# Altium schematic sheet [2] ESP32.SchDoc: ESP32 KIT
size C; Organization: Altium Limited; Address1: L3, 12a Rodborough Rd; Address2: Frenchs Forest; Address3: NSW; Address4: Australia 2086; DocumentNumber: 2; Revision: 1.0; SheetNumber: 2; SheetTotal: 3
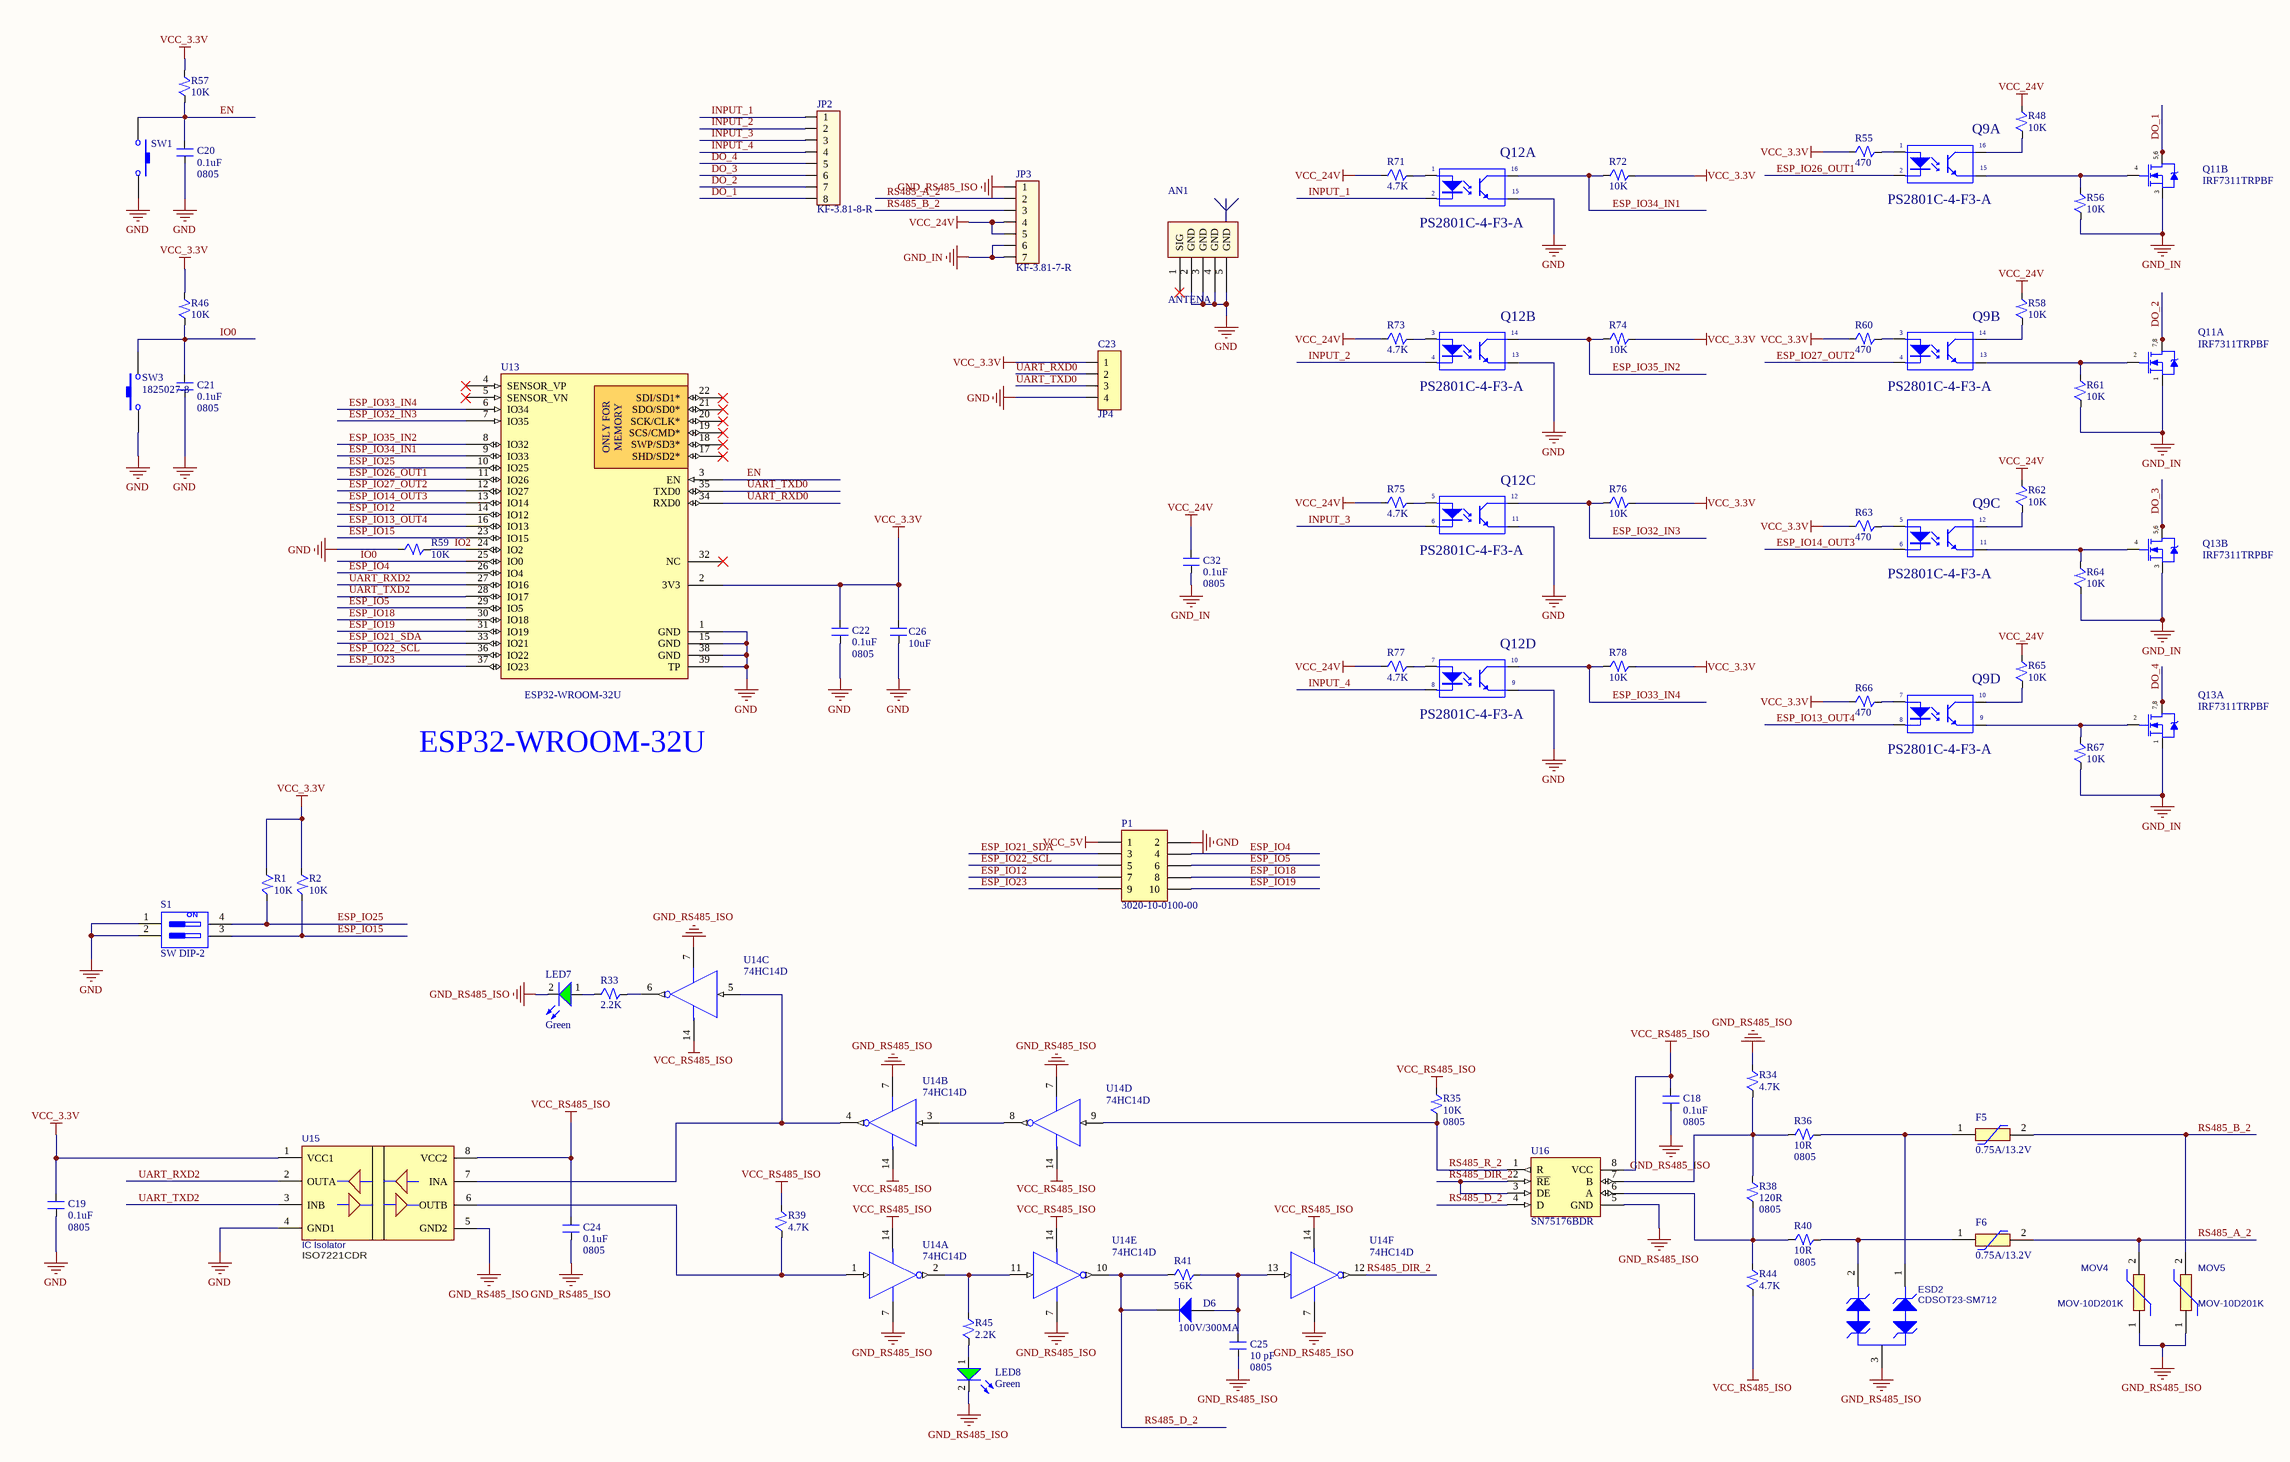
[diagram p0: [2] ESP32.SchDoc]

## Parts
AN1  ANTENA  [DE ANTEN SMA CONG]
C18  0.1uF  Package: 0805  [CN-SMD-0805]
C19  0.1uF  Package: 0805  [CN-SMD-0805]
C20  0.1uF  Package: 0805  [CN-SMD-0805]
C21  0.1uF  Package: 0805  [CN-SMD-0805]
C22  0.1uF  Package: 0805  [CN-SMD-0805]
C23  JP4  [JP4-C1T]
C24  0.1uF  Package: 0805  [CN-SMD-0805]
C25  10 pF  Package: 0805  [CN-SMD-0805]
C26  10uF  [CN-SMD-0805]
C32  0.1uF  Package: 0805  [CN-SMD-0805]
D6  100V/300MA  [SOD-123]
ESD2  CDSOT23-SM712  [SOT-323_ESD]
F5  0.75A/13.2V  [MINISMDC050F2]
F6  0.75A/13.2V  [MINISMDC050F2]
JP2  KF-3.81-8-R  [KF-3.81-8-R]
JP3  KF-3.81-7-R  [KF-3.81-7-R]
LED7  value Green  [LED5G]  (hidden comment: LED_G_5)
LED8  value Green  [LED5G]  (hidden comment: LED_G_5)
MOV4  MOV-10D201K  [MOV10D201KTR]
MOV5  MOV-10D201K  [MOV10D201KTR]
P1  3020-10-0100-00  [IDC_HDR_M_2X5_2.54_THG]
Q9  PS2801C-4-F3-A  [PS2801C-4_REN-L]  (parts A,B,C,D of 4)
Q11  IRF7311TRPBF  [SO8]  (parts A,B of 2)
Q12  PS2801C-4-F3-A  [PS2801C-4_REN-L]  (parts A,B,C,D of 4)
Q13  IRF7311TRPBF  [SO8]  (parts A,B of 2)
R1  10K  [RES_0805]
R2  10K  [RES_0805]
R33  2.2K  [RES_0805]
R34  4.7K  [RES_0805]
R35  10K  Package: 0805  [RES_0805]
R36  10R  Package: 0805  [RES_0805]
R38  120R  Package: 0805  [RES_0805]
R39  4.7K  [RES_0805]
R40  10R  Package: 0805  [RES_0805]
R41  56K  [RES_0805]
R44  4.7K  [RES_0805]
R45  2.2K  [RES_0805]
R46  10K  [RES_0805]
R48  10K  [RES_0805]
R55  470  [RES_0805]
R56  10K  [RES_0805]
R57  10K  [RES_0805]
R58  10K  [RES_0805]
R59  10K  [RES_0805]
R60  470  [RES_0805]
R61  10K  [RES_0805]
R62  10K  [RES_0805]
R63  470  [RES_0805]
R64  10K  [RES_0805]
R65  10K  [RES_0805]
R66  470  [RES_0805]
R67  10K  [RES_0805]
R71  4.7K  [RES_0805]
R72  10K  [RES_0805]
R73  4.7K  [RES_0805]
R74  10K  [RES_0805]
R75  4.7K  [RES_0805]
R76  10K  [RES_0805]
R77  4.7K  [RES_0805]
R78  10K  [RES_0805]
S1  SW DIP-2  [DIP-SW-2-SIDE ENTRY]
SW1  RS-282G05A3-SM RT  [SW_RS-282G05A3-SM RT]  (value not drawn)
SW3  1825027-8  [SW_1825027-8]
U13  ESP32-WROOM-32U  [ESP32-WROOM-32U]
U14  74HC14D  [SOIC-14]  (parts A,B,C,D,E,F of 6)
U15  IC Isolator  Part Number: ISO7221CDR  [8-SOIC_ISO]
U16  SN75176BDR  [SOIC-8]

## Nets
GND: AN1.2(GND) AN1.3(GND) AN1.4(GND) AN1.5(GND) C19.1 C20.1 C21.1 C22.1 C23.4 C26.1 P1.2 Q12.9 Q12.11 Q12.13 Q12.15 R59.1 S1.1(A1) S1.2(A2) SW1.2 SW3.1 U13.1(GND) U13.15(GND) U13.38(GND) U13.39(TP) U15.4(GND1)
GND_IN: C32.1 JP3.6 JP3.7 Q11.1(S) Q11.3(S) Q13.1(S) Q13.3(S) R56.1 R61.1 R64.1 R67.1
GND_RS485_ISO: C18.1 C24.1 C25.1 ESD2.3(A) JP3.1 LED7.2(K) LED8.2(K) MOV4.1 MOV5.1 R34.2 U14.7(GND) U15.5(GND2) U16.5(GND)
VCC_3.3V: C19.2 C22.2 C23.1 C26.2 R1.1 R2.1 R46.2 R55.1 R57.2 R60.1 R63.1 R66.1 R72.2 R74.2 R76.2 R78.2 U13.2(3V3) U15.1(VCC1)
VCC_5V: P1.1
VCC_24V: C32.2 JP3.4 JP3.5 R48.2 R58.2 R62.2 R65.2 R71.1 R73.1 R75.1 R77.1
VCC_RS485_ISO: C18.2 C24.2 R35.2 R39.2 R44.1 U14.14(VCC) U15.8(VCC2) U16.8(VCC)
DO_1: JP2.8 Q11.5(D) Q11.6(D)
DO_2: JP2.7 Q11.7(D) Q11.8(D)
DO_3: JP2.6 Q13.5(D) Q13.6(D)
DO_4: JP2.5 Q13.7(D) Q13.8(D)
EN: C20.2 R57.1 SW1.1 U13.3(EN)
ESP_IO4: P1.4 U13.26(IO4)
ESP_IO5: P1.6 U13.29(IO5)
ESP_IO12: P1.7 U13.14(IO12)
ESP_IO13_OUT4: Q9.8 U13.16(IO13)
ESP_IO14_OUT3: Q9.6 U13.13(IO14)
ESP_IO15: R2.2 S1.3(B2) U13.23(IO15)
ESP_IO18: P1.8 U13.30(IO18)
ESP_IO19: P1.10 U13.31(IO19)
ESP_IO21_SDA: P1.3 U13.33(IO21)
ESP_IO22_SCL: P1.5 U13.36(IO22)
ESP_IO23: P1.9 U13.37(IO23)
ESP_IO25: R1.2 S1.4(B1) U13.10(IO25)
ESP_IO26_OUT1: Q9.2 U13.11(IO26)
ESP_IO27_OUT2: Q9.4 U13.12(IO27)
ESP_IO32_IN3: Q12.12 R76.1 U13.7(IO35)
ESP_IO33_IN4: Q12.10 R78.1 U13.6(IO34)
ESP_IO34_IN1: Q12.16 R72.1 U13.9(IO33)
ESP_IO35_IN2: Q12.14 R74.1 U13.8(IO32)
INPUT_1: JP2.1 Q12.2
INPUT_2: JP2.2 Q12.4
INPUT_3: JP2.3 Q12.6
INPUT_4: JP2.4 Q12.8
IO0: C21.2 R46.1 SW3.2 U13.25(IO0)
IO2: R59.2 U13.24(IO2)
RS485_A_2: F6.2 JP3.2 MOV4.2
RS485_B_2: F5.2 JP3.3 MOV5.2
RS485_D_2: D6.2(K) R41.1 U14.10(5Y) U16.4(D)
RS485_DIR_2: U14.12(6Y) U16.2(~{RE}) U16.3(DE)
RS485_R_2: R35.1 U14.9(4A) U16.1(R)
UART_RXD0: C23.2 U13.34(RXD0)
UART_RXD2: U13.27(IO16) U15.2(OUTA)
UART_TXD0: C23.3 U13.35(TXD0)
UART_TXD2: U13.28(IO17) U15.3(INB)
NetC25_2: C25.2 D6.1(A) R41.2 U14.13(6A)
NetESD2_1: ESD2.1(K) F5.1 R36.2
NetESD2_2: ESD2.2(K) F6.1 R40.2
NetLED7_1: LED7.1(A) R33.1
NetLED8_1: LED8.1(A) R45.1
NetQ9_1: Q9.1 R55.2
NetQ9_3: Q9.3 R60.2
NetQ9_5: Q9.5 R63.2
NetQ9_7: Q9.7 R66.2
NetQ9_9: Q9.9 Q13.2(G) R67.2
NetQ9_10: Q9.10 R65.1
NetQ9_11: Q9.11 Q13.4(G) R64.2
NetQ9_12: Q9.12 R62.1
NetQ9_13: Q9.13 Q11.2(G) R61.2
NetQ9_14: Q9.14 R58.1
NetQ9_15: Q9.15 Q11.4(G) R56.2
NetQ9_16: Q9.16 R48.1
NetQ12_1: Q12.1 R71.2
NetQ12_3: Q12.3 R73.2
NetQ12_5: Q12.5 R75.2
NetQ12_7: Q12.7 R77.2
NetR33_2: R33.2 U14.6(3Y)
NetR34_1: R34.1 R36.1 R38.2 U16.7(B)
NetR38_1: R38.1 R40.1 R44.2 U16.6(A)
NetR39_1: R39.1 U14.1(1A) U15.6(OUTB)
NetR45_2: R45.2 U14.2(1Y) U14.11(5A)
NetU14_3: U14.3(2A) U14.8(4Y)
NetU14_4: U14.4(2Y) U14.5(3A) U15.7(INA)

Not connected (* = marked no-connect by the designer): AN1 1(SIG)*; U13 4(SENSOR_VP)* 5(SENSOR_VN)* 17(SHD/SD2*)* 18(SWP/SD3*)* 19(SCS/CMD*)* 20(SCK/CLK*)* 21(SDO/SD0*)* 22(SDI/SD1*)* 32(NC)*

## Notes on the sheet
- ESP32-WROOM-32U
- Title
- Size:
- Date:
- File:
- C
- Number:
- Time:
- Revision:
- Sheet
- of
- (in symbol ESP32-WROOM-32U) ONLY FOR; MEMORY
- (in symbol IRF7311TRPBF, part A) 7,8
- (in symbol IRF7311TRPBF, part B) 5,6
- (in symbol SW DIP-2) ON

## Library data of the parts
AN1 = ANTEN SMA CONG: Generic Antenna
C18-C22 C24 C25 C32 = CAP 0.1uF 0805 10% 50V: CAP CER 0.1UF 50V 0805; Manufacturer: Minh Hà; Part Number: Tụ 0805 104-100nF 10% 50V; Tolerance: 10%; Dielectric: X5R; Voltage: 50V; ComponentLink1Description: Link VN; ComponentLink1URL: https://banlinhkien.com/tu-0805-104100nf-10-50v-10c-p6650428.html; Value: 0.1uF; Supplier: Minh Hà; Buy Link: https://banlinhkien.com/tu-0805-104100nf-10-50v-10c-p6650428.html
C23 = JP4: WR-PHD 2.54 mm Angled Socket Header; Manufacturer: W¨¹rth Elektronik eiSos GmbH; partNo: 613004143121; ComponentLink1 Description: Manufacturer; ComponentLink2 Description: Datasheet; NoPins: 04; Created Date: 29 March 2013; ComponentLink1URL: http://www.we-online.com; ComponentLink2URL: http://katalog.we-online.de/em/datasheet/6130xx143121.pdf; Created by: Karrer Zheng
C26 = CAP 10uF 0805 10% 16V: CAP CER 10UF 16V 0805; Manufacturer: Minh Hà; Part Number: Tụ 0805 106-10uF 10% 16V; Tolerance: 10%; Dielectric: X5R; Package: 0805; Voltage: 16V; ComponentLink1Description: Link VN; ComponentLink1URL: https://banlinhkien.com/tu-0805-10610uf-10-16v-10c-p6650430.html; Value: 10uF
D6 = 1N4148-W-7: DIODE GEN PURP 100V 300MA SOD123; Part Number: 1N4148W-7-F; Manufacturer: Diodes Incorporated; Value: 100V/300MA
ESD2 = CDSOT23-SM712: ESD 2 channel 12V, 26V Max Voltage Clamp 17A, 13.3V Typ Breakdown Voltage, Max -V Reverse Standoff Voltage, Bidirectional, Capacitance 75 pF Typ; Manufacturer: Bourns; Ma thay the VN: No; Cross PN: PESD24VL2BT,215; Cross DES: TVS DIODE 24VWM 70VC TO236AB 70V Clamp 3A; Cross MNF: Nexperia USA Inc.; Part Number: CDSOT23-SM712; ComponentLink1Description: Datasheet; ComponentLink1URL: https://www.mouser.vn/datasheet/2/54/CDSOT23-SM712-1635169.pdf; ComponentLink2Description: Link tham khao; ComponentLink2URL: https://www.mouser.vn/ProductDetail/Bourns/CDSOT23-SM712?qs=FuI%252BOVLl4%2FLTY%2FGQ265RLA%3D%3D; ComponentLink3Description: Link VN; ComponentLink3URL: No; Type: ESD
F5 F6 = MINISMDC075F-2: PTC RESET FUSE 13.2V 750MA 1812; Manufacturer: LITTELFUSE; Datasheet Link: https://componentsearchengine.com/Datasheets/2/MINISMDC050F-2.pdf; Part Number: MINISMDC075F-2
JP2 = Con_8C: Terminal Block Plug-in Hàn PCB Chân Cong 3.81mm; Value: Connector 3; BuyLink: https://www.thegioiic.com/products/kf142-5-08-3-r-terminal-block-3-tiep-diem-cam-day-ngang-5-08mm; ComponentLink1Description: Buy link; ComponentLink1URL: https://www.thegioiic.com/products/kf-3-81-3-r-terminal-block-plug-in-han-pcb-3-chan-cong-3-81mm
JP3 = Con_7C: Terminal Block Plug-in Hàn PCB Chân Cong 3.81mm; Value: Connector 3; BuyLink: https://www.thegioiic.com/products/kf142-5-08-3-r-terminal-block-3-tiep-diem-cam-day-ngang-5-08mm; ComponentLink1Description: Buy link; ComponentLink1URL: https://www.thegioiic.com/products/kf-3-81-3-r-terminal-block-plug-in-han-pcb-3-chan-cong-3-81mm
LED7 LED8 = LED_GREEN_5MM: LED Green 5mm; ComponentLink1Description: Datasheet; ComponentLink1URL: D:\Dropbox\Datasheets\Opto and Illumination\LEDs\SMD LED.pdf; Unit Price: 0.0476
MOV4 MOV5 = MOV-10D201K: MOV 225V 250pF 340V Clamp Voltage 2.5 kA 10%; Manufacturer: Bourns; Ma thay the VN: No; Part Number: MOV-10D201K; ComponentLink1Description: Datasheet; ComponentLink1URL: https://www.mouser.vn/datasheet/2/54/mov10d-777448.pdf; ComponentLink2Description: Link tham khao; ComponentLink2URL: https://www.mouser.vn/ProductDetail/Bourns/MOV-10D201K?qs=lgttKnAd%252B2CB2e2%2FC517%252BQ%3D%3D; ComponentLink3Description: Link VN; ComponentLink3URL: No; Type: Varistor
P1 = IDC_HDR_M_3020-10-0100-00: IDC BOX HEADER .100" 10POS; Manufacturer: CNC Tech; Pitch - Mating: 0.100" (2.54mm); Number of Positions: 10; Number of Positions Loaded: All; Style: Board to Cable/Wire; Shrouding: Shrouded - 4 Wall; Contact Length - Post: 0.118" (3.00mm); Material Flammability Rating: UL94 V-0; Current Rating: 1A; Supplier 1: Digi-Key; Manufacturer Part Number: 3020-10-0100-00; RoHS: RoHS Compliant; Category: Connectors, Interconnects; Stock 1: 24035; Pricing 1: 1=0.48, 10=0.45, 100=0.345, 500=0.3, 1000=0.2475, 5000=0.2175, 10000=0.2025 (USD); Packaging: Tray; Part Status: Active; Connector Type: Header; Contact Type: Male Pin; Number of Rows: 2; Row Spacing - Mating: 0.100" (2.54mm); Mounting Type: Through Hole; Termination: Solder; Fastening Type: Push-Pull; Contact Length - Mating: -; Overall Contact Length: -; Insulation Height: 0.354" (9.00mm); Contact Shape: Square; Contact Finish - Mating: Gold; Contact Finish Thickness - Mating: Flash; Contact Finish - Post: -; Contact Material: Brass; Insulation Material: Polyamide (PA6T), Nylon 6T; Features: Keying Slot; Operating Temperature: -40°C ~ 105°C; Ingress Protection: -; Insulation Color: -; Voltage Rating: -; Mated Stacking Heights: -; Contact Finish Thickness - Post: -; Applications: -; ComponentLink1URL: http://cnctech.us/pdfs/3020-XX-0100-00.pdf; ComponentLink1Description: http://cnctech.us/pdfs/3020-XX-0100-00.pdf; Supplier Part Number 1: 1175-1609-ND
Q9 Q12 = PS2801C-4_MH: Manufacturer: Renesas Electronics; Datasheet: https://www.renesas.com/us/en/doc/products/opt/r08ds0072ej0402-ps2801c-1-ps2801c-4.pdf; Part Number: PS2801C-4-F3-A; ComponentLink1Description: Link VN; ComponentLink1URL: https://banlinhkien.com/ps28014-sop16-ic-opto-trans-50ma-80v-p6650617.html
Q11 Q13 = IRF7311TRPBF: MOSFET N-2CH 6.6A 20V 29mOhm 8-SOIC; Manufacturer: Infineon Technologies; Cross PN: AO4818B/NTMD4840NR2G; Cross DES: MOSFET 2N-CH 30V 8A 8-SOIC; Cross MNF: Alpha & Omega Semiconductor Inc.; Published: 8-Jun-2000; LatestRevisionDate: 13-Apr-2006; LatestRevisionNote: IPC-7351 Footprint Added.; DatasheetVersion: Aug-1997; PackageVersion: Feb-2001; PackageReference: SO-8; Publisher: Altium Limited; PackageDescription: 8-Pin Plastic Small Outline Integrated Circuit 1.27 mm Pitch; Code_JEDEC: MS-012-AA; Code_IPC: SOIC127P600-8; ComponentLink1Description: Manufacturer Link; ComponentLink1URL: http://www.irf.com/; ComponentLink2Description: Datasheet; ComponentLink2URL: https://www.infineon.com/dgdl/irf7311pbf.pdf?fileId=5546d462533600a4015355f551ed1b22; Part Number: IRF7311TRPBF
R1 R2 R35 R46 R48 R56-R59 R61 R62 R64 R65 R67 R72 R74 R76 R78 = RES 10K 0805 1% 1/8W: Điện Trở 10 KOhm 0805 1% 1/8W /; Part Number: Trở 0805 1% 10K; Manufacturer: Minh Hà; ComponentLink1Description: Link VN; ComponentLink1URL: https://banlinhkien.com/tro-0805-1-10k-50c-p6651952.html; Tolerance: 1%; Power: 1/8W
  R1 R2 R46 R48 R56-R59 R61 R62 R64 R65 R67 R72 R74 R76 R78: Package: 0805
R33 R45 = RES 2.2K 0805 1% 1/8W: Điện Trở 2.2 KOhm 0805 1% 1/8W /; Part Number: Trở 0805 1% 2.2K; Manufacturer: Minh Hà; ComponentLink1Description: Link VN; ComponentLink1URL: https://banlinhkien.com/tro-0805-1-2.2k-50c-p17663512.html; Package: 0805; Tolerance: 1%; Power: 1/8W
R34 R39 R44 R71 R73 R75 R77 = RES 4.7K 0805 1% 1/8W: Điện Trở 4.7 KOhm 0805 1% 1/8W /; Part Number: Trở 0805 1% 4.7K; Manufacturer: Minh Hà; ComponentLink1Description: Link VN; ComponentLink1URL: https://banlinhkien.com/tro-0805-1-4.7k-50c-p12913923.html; Package: 0805; Tolerance: 1%; Power: 1/8W
R36 R40 = RES 10R 0805 1% 1/8W: Điện Trở 10 Ohm 0805 1% 1/8W /; Part Number: Trở 0805 1% 10R; Manufacturer: Minh Hà; ComponentLink1Description: Link VN; ComponentLink1URL: https://banlinhkien.com/tro-0805-1-10r-50c-p6651953.html; Tolerance: 1%; Power: 1/8W
R38 = RES 120R 0805 1% 1/8W: Điện Trở 120 Ohm 0805 1% 1/8W /; Part Number: Trở 0805 1% 120R; Manufacturer: Minh Hà; ComponentLink1Description: Link VN; ComponentLink1URL: https://banlinhkien.com/tro-0805-1-120r-50c-p17332149.html; Tolerance: 1%; Power: 1/8W
R41 = RES 56K 0805 5% 1/8W: Điện Trở 56 KOhm 0805 5% 1/8W /; Part Number: Trở 0805 5% 56K; Manufacturer: Thế Giới IC; ComponentLink1Description: Link VN; ComponentLink1URL: https://www.thegioiic.com/products/dien-tro-56-kohm-0805-5; Package: 0805; Tolerance: 5%; Power: 1/8W
R55 R60 R63 R66 = RES 470R 0805 1% 1/8W: Điện Trở 470 Ohm 0805 1% 1/8W /; Part Number: Trở 0805 1% 470R; Manufacturer: Minh Hà; ComponentLink1Description: Link VN; ComponentLink1URL: https://banlinhkien.com/tro-0805-1-470r-50c-p17823145.html; Package: 0805; Tolerance: 1%; Power: 1/8W
S1 = SW DIP-2: DIP Switch, 2 Position, SPST; Published: 24-Mar-1999; LatestRevisionDate: 17-Jul-2002; LatestRevisionNote: Re-released for DXP Platform.; PackageReference: DIP-4; Publisher: Altium Limited
SW1 = SW_RS-282G05A3-SM RT: SWITCH TACTILE SPST-NO 0.05A 12V; Manufacturer: C&K; Switch Function: Off-Mom; Contact Rating @ Voltage: 0.05A @ 12VDC; Actuator Type: Rectangular Button; Actuator Height off PCB, Vertical: 2.50mm; Actuator Orientation: Top Actuated; Outline: 6.00mm x 3.60mm; Illumination: Non-Illuminated; Operating Force: 250gf; Actuator Material: Polyamide (PA), Nylon; Switch Travel: 0.25mm; Mechanical Life: 50,000 Cycles; Supplier 1: Digi-Key; Part Number: RS-282G05A3-SM RT; RoHS: RoHS Compliant; Category: Switches; Stock 1: 34459; Pricing 1: 1=0.81, 10=0.78, 25=0.7356, 50=0.6474, 100=0.5885, 250=0.55908, 500=0.54436, 1000=0.42666 (USD); Packaging: Digi-Reel®; Part Status: Active; Circuit: SPST-NO; Mounting Type: Surface Mount; Actuator Length, Right Angle: -; Termination Style: Gull Wing; Illumination Type, Color: -; Illumination Voltage (Nominal): -; Ingress Protection: -; Features: -; Operating Temperature: -; ComponentLink1URL: http://media.digikey.com/pdf/Data%20Sheets/C&K/RS-282G05A-SM_RT.pdf; ComponentLink1Description: http://media.digikey.com/pdf/Data%20Sheets/C&K/RS-282G05A-SM_RT.pdf; Supplier Part Number 1: CKN10384DKR-ND
SW3 = SW_1825027-8: SWITCH TACTILE SPST-NO 0.05A 24V; Manufacturer: TE Connectivity ALCOSWITCH Switches; Switch Function: Off-Mom; Contact Rating @ Voltage: 0.05A @ 24VDC; Actuator Type: Standard; Actuator Length, Right Angle: 5.85mm; Actuator Orientation: Side Actuated; Outline: 7.10mm x 7.00mm; Illumination: Non-Illuminated; Operating Force: 160gf; Actuator Material: Polyamide (PA), Nylon; Switch Travel: 0.25mm; Mechanical Life: 100,000 Cycles; Supplier 1: Digi-Key; Manufacturer Part Number: 1825027-8; RoHS: RoHS Compliant; Category: Switches; Stock 1: 10500; Pricing 1: 1=0.14, 10=0.132, 25=0.1276, 50=0.1228, 100=0.116, 250=0.1092, 500=0.10466, 1000=0.07963, 5000=0.06598 (USD); Packaging: Bulk; Part Status: Active; Circuit: SPST-NO; Mounting Type: Through Hole, Right Angle; Actuator Height off PCB, Vertical: -; Termination Style: PC Pin; Illumination Type, Color: -; Illumination Voltage (Nominal): -; Ingress Protection: -; Features: -; Operating Temperature: -35°C ~ 85°C; ComponentLink1URL: http://www.te.com/commerce/DocumentDelivery/DDEController?Action=srchrtrv&DocNm=1825027&DocType=Customer+Drawing&DocLang=English; ComponentLink1Description: http://www.te.com/commerce/DocumentDelivery/DDEController?Action=srchrtrv&DocNm=1825027&DocType=Customer+Drawing&DocLang=English; Supplier Part Number 1: 450-1657-ND
U13 = ESP32-WROOM-32U: Wi-Fi/BT BLE Module ESP32-D0WD; Manufacturer: Espressif; Solder: SMT; Price: None; Value: ESP32-WROOM-32U; Supplier: Thế Giới IC; Buy Link: https://www.thegioiic.com/products/esp-wroom-32u-mach-thu-phat-wifi; Part Number: ESP32-WROOM-32U; PinCount: 40; ComponentLink1Description: Link VN; ComponentLink1URL: https://www.thegioiic.com/products/esp-wroom-32u-mach-thu-phat-wifi
U14 = 74HC14D_NXP: IC INVERTER SCHMITT TRIGGER 6CH 6-INP; Manufacturer: Nexperia USA Inc; Number of Inputs: 6; Voltage - Supply: 2 V ~ 6 V; Current - Output High, Low: 5.2mA, 5.2mA; Logic Level - Low: 0.3 V ~ 1.2 V; Logic Level - High: 1.5 V ~ 4.2 V; Max Propagation Delay @ V, Max CL: 21ns @ 6V, 50pF; Supplier 1: Digi-Key; Part Number: 74HC14D; RoHS: RoHS Compliant; Category: Integrated Circuits (ICs); Stock 1: 7794; Pricing 1: 1=0.37, 10=0.278, 100=0.1733, 500=0.11856, 1000=0.0912 (USD); Packaging: Tube; Part Status: Active; Logic Type: Inverter; Features: Schmitt Trigger; Operating Temperature: -40°C ~ 125°C; Mounting Type: Surface Mount; Supplier Device Package: 14-SO; Package / Case: 14-SOIC (0.154", 3.90mm Width); Base Part Number: 74HC14; ComponentLink1URL: https://assets.nexperia.com/documents/data-sheet/74HC_HCT14.pdf; ComponentLink1Description: https://assets.nexperia.com/documents/data-sheet/74HC_HCT14.pdf; Supplier Part Number 1: 1727-3781-ND; ComponentLink2Description: Link VN; ComponentLink2URL: https://banlinhkien.com/74hc14d-sop14-p6648430.html
U15 = ISO7221CD: IC Isolator 2.8V ~ 5.5V 2 Channels 25Mbps; Manufacturer: Texas Instruments; Ma thay the VN: No; ComponentLink1Description: Datasheet; ComponentLink1URL: https://www.ti.com/lit/ds/symlink/iso7220a.pdf?HQS=dis-dk-null-digikeymode-dsf-pf-null-wwe&ts=1644914438304&ref_url=https%253A%252F%252Fwww.ti.com%252Fgeneral%252Fdocs%252Fsuppproductinfo.tsp%253FdistId%253D10%2526gotoUrl%253Dhttps%253A%252F%252Fwww.ti.com%252Flit%252Fgpn%252Fiso7220a; ComponentLink2Description: Link tham khao; ComponentLink2URL: https://www.lcsc.com/product-detail/Pre-ordered-Products_Texas-Instruments-ISO7221CD_C2872999.html; ComponentLink3Description: Link VN; ComponentLink3URL: No; Type: IC; Supplier: Shenzhen JYWY Electronics
U16 = SN75176BDR: IC TXRX DIFF BUSS 8SOIC; Manufacturer: Texas Instruments; Part Number: SN75HVD08DR; Protocol: RS422, RS485; Number of Drivers/Receivers: 1/1; Duplex: Half; Voltage - Supply: 4.75 V ~ 5.25 V; Supplier 1: Digi-Key; Manufacturer Part Number: SN75176BDR; RoHS: RoHS Compliant; Category: Integrated Circuits (ICs); Stock 1: 19898; Pricing 1: 1=1.46, 10=1.31, 100=1.021, 500=0.84346, 1000=0.6659 (USD); Packaging: Cut Tape (CT); Part Status: Active; Type: Transceiver; Data Rate: -; Operating Temperature: 0°C ~ 70°C; Mounting Type: Surface Mount; Package / Case: 8-SOIC (0.154", 3.90mm Width); Supplier Device Package: 8-SOIC; ComponentLink1URL: http://www.ti.com/lit/ds/symlink/sn65176b.pdf; ComponentLink1Description: http://www.ti.com/lit/ds/symlink/sn65176b.pdf; Supplier Part Number 1: 296-1275-1-ND; Supplier: EPI; Buy Link: N/A